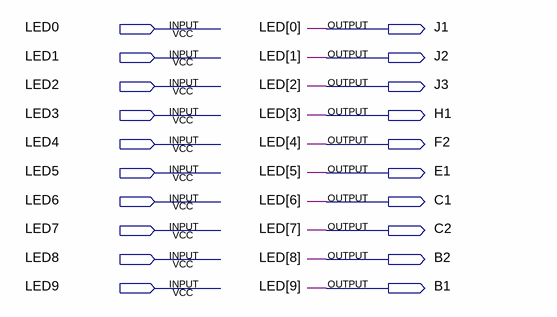
[diagram p0: schematic sheet]
// Quartus schematic LedS.bdf as structural Verilog: 0 symbols, 20 pins
module LedS (
  input  LED0,
  input  LED1,
  input  LED2,
  input  LED3,
  input  LED4,
  input  LED5,
  input  LED6,
  input  LED7,
  input  LED8,
  input  LED9,
  output J1,
  output J2,
  output J3,
  output H1,
  output F2,
  output E1,
  output C1,
  output C2,
  output B2,
  output B1
);


  assign B1 = LED9;
  assign B2 = LED8;
  assign C1 = LED6;
  assign C2 = LED7;
  assign E1 = LED5;
  assign F2 = LED4;
  assign H1 = LED3;
  assign J1 = LED0;
  assign J2 = LED1;
  assign J3 = LED2;
endmodule
